# Altium schematic sheet мезанин.SchDoc
size 420 x 297 mm; SheetNumber: 2; SheetTotal: 6
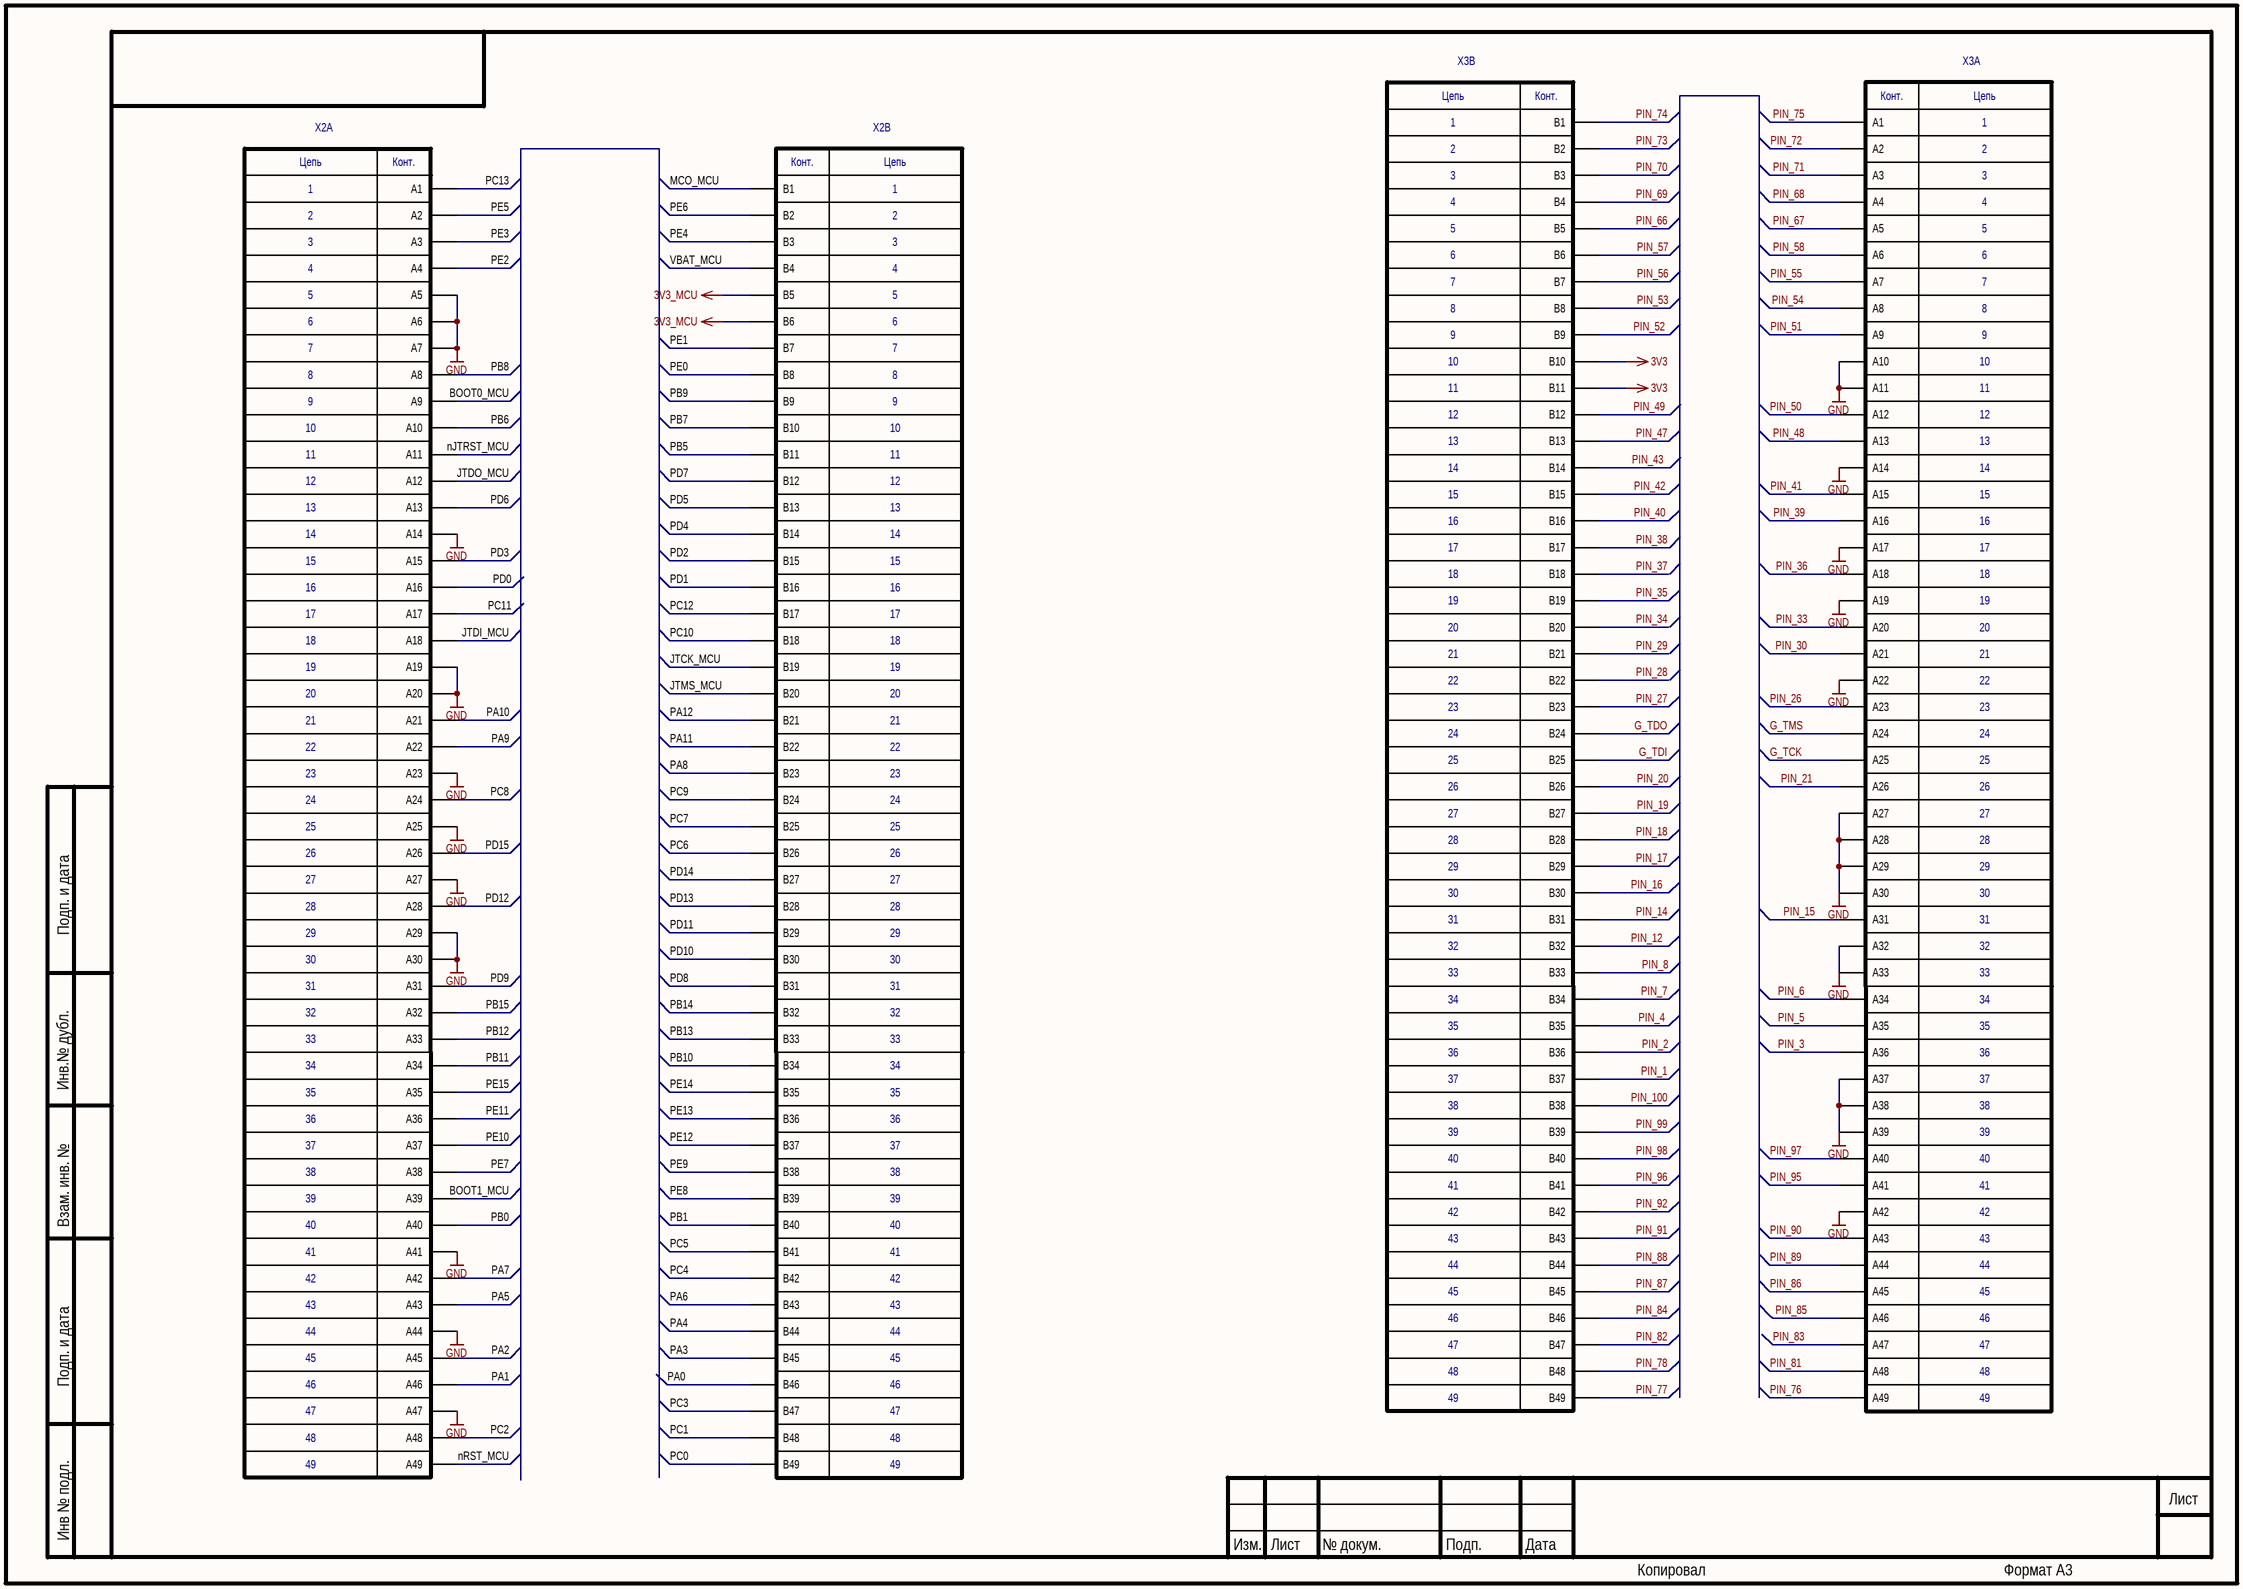
[diagram p0: мезанин.SchDoc]

## Parts
X2  KONT_POLE_MEZ  [3113-112T]  (value not drawn)  (parts A,B of 2)
X3  KONT_POLE_MEZ  [3113-112T]  (value not drawn)  (parts A,B of 2)

## Nets
3V3: X3.B10 X3.B11
3V3_MCU: X2.B5 X2.B6
GND: X2.A5 X2.A6 X2.A7 X2.A14 X2.A19 X2.A20 X2.A23 X2.A25 X2.A27 X2.A29 X2.A30 X2.A41 X2.A44 X2.A47 X3.A10 X3.A11 X3.A14 X3.A17 X3.A19 X3.A22 X3.A27 X3.A28 X3.A29 X3.A30 X3.A32 X3.A33 X3.A37 X3.A38 X3.A39 X3.A42
BOOT0_MCU: X2.A9
BOOT1_MCU: X2.A39
G_TCK: X3.A25
G_TDI: X3.B25
G_TDO: X3.B24
G_TMS: X3.A24
JTCK_MCU: X2.B19
JTDI_MCU: X2.A18
JTDO_MCU: X2.A12
JTMS_MCU: X2.B20
MCO_MCU: X2.B1
nJTRST_MCU: X2.A11
nRST_MCU: X2.A49
PA0: X2.B46
PA1: X2.A46
PA2: X2.A45
PA3: X2.B45
PA4: X2.B44
PA5: X2.A43
PA6: X2.B43
PA7: X2.A42
PA8: X2.B23
PA9: X2.A22
PA10: X2.A21
PA11: X2.B22
PA12: X2.B21
PB0: X2.A40
PB1: X2.B40
PB5: X2.B11
PB6: X2.A10
PB7: X2.B10
PB8: X2.A8
PB9: X2.B9
PB10: X2.B34
PB11: X2.A34
PB12: X2.A33
PB13: X2.B33
PB14: X2.B32
PB15: X2.A32
PC0: X2.B49
PC1: X2.B48
PC2: X2.A48
PC3: X2.B47
PC4: X2.B42
PC5: X2.B41
PC6: X2.B26
PC7: X2.B25
PC8: X2.A24
PC9: X2.B24
PC10: X2.B18
PC11: X2.A17
PC12: X2.B17
PC13: X2.A1
PD0: X2.A16
PD1: X2.B16
PD2: X2.B15
PD3: X2.A15
PD4: X2.B14
PD5: X2.B13
PD6: X2.A13
PD7: X2.B12
PD8: X2.B31
PD9: X2.A31
PD10: X2.B30
PD11: X2.B29
PD12: X2.A28
PD13: X2.B28
PD14: X2.B27
PD15: X2.A26
PE0: X2.B8
PE1: X2.B7
PE2: X2.A4
PE3: X2.A3
PE4: X2.B3
PE5: X2.A2
PE6: X2.B2
PE7: X2.A38
PE8: X2.B39
PE9: X2.B38
PE10: X2.A37
PE11: X2.A36
PE12: X2.B37
PE13: X2.B36
PE14: X2.B35
PE15: X2.A35
PIN_1: X3.B37
PIN_2: X3.B36
PIN_3: X3.A36
PIN_4: X3.B35
PIN_5: X3.A35
PIN_6: X3.A34
PIN_7: X3.B34
PIN_8: X3.B33
PIN_12: X3.B32
PIN_14: X3.B31
PIN_15: X3.A31
PIN_16: X3.B30
PIN_17: X3.B29
PIN_18: X3.B28
PIN_19: X3.B27
PIN_20: X3.B26
PIN_21: X3.A26
PIN_26: X3.A23
PIN_27: X3.B23
PIN_28: X3.B22
PIN_29: X3.B21
PIN_30: X3.A21
PIN_33: X3.A20
PIN_34: X3.B20
PIN_35: X3.B19
PIN_36: X3.A18
PIN_37: X3.B18
PIN_38: X3.B17
PIN_39: X3.A16
PIN_40: X3.B16
PIN_41: X3.A15
PIN_42: X3.B15
PIN_43: X3.B14
PIN_47: X3.B13
PIN_48: X3.A13
PIN_49: X3.B12
PIN_50: X3.A12
PIN_51: X3.A9
PIN_52: X3.B9
PIN_53: X3.B8
PIN_54: X3.A8
PIN_55: X3.A7
PIN_56: X3.B7
PIN_57: X3.B6
PIN_58: X3.A6
PIN_66: X3.B5
PIN_67: X3.A5
PIN_68: X3.A4
PIN_69: X3.B4
PIN_70: X3.B3
PIN_71: X3.A3
PIN_72: X3.A2
PIN_73: X3.B2
PIN_74: X3.B1
PIN_75: X3.A1
PIN_76: X3.A49
PIN_77: X3.B49
PIN_78: X3.B48
PIN_81: X3.A48
PIN_82: X3.B47
PIN_83: X3.A47
PIN_84: X3.B46
PIN_85: X3.A46
PIN_86: X3.A45
PIN_87: X3.B45
PIN_88: X3.B44
PIN_89: X3.A44
PIN_90: X3.A43
PIN_91: X3.B43
PIN_92: X3.B42
PIN_95: X3.A41
PIN_96: X3.B41
PIN_97: X3.A40
PIN_98: X3.B40
PIN_99: X3.B39
PIN_100: X3.B38
VBAT_MCU: X2.B4

## Notes on the sheet
- Подп. и дата
- Инв.№ дубл.
- Взам. инв. №
- Инв № подл.
- Изм.
- Лист
- № докум.
- Подп.
- Дата
- Копировал
- Формат А3
- (in symbol 3113-112T, part A) Конт.; Цепь; 1; 2; 3; 4; 5; 6; 7; 8; 9; 10; 11; 12; 13; 14; 15; 16; 17; 18; 19; 20; 21; 22; 23; 24; 25; 26; 27; 28; 29; 30; 31; 32; 33; 34; 35; 36; 37; 38; 39; 40; 41; 42; 43; 44; 45; 46; 47; 48; 49
- (in symbol 3113-112T, part B) Цепь; Конт.; 1; 2; 3; 4; 5; 6; 7; 8; 9; 10; 11; 12; 13; 14; 15; 16; 17; 18; 19; 20; 21; 22; 23; 24; 25; 26; 27; 28; 29; 30; 31; 32; 33; 34; 35; 36; 37; 38; 39; 40; 41; 42; 43; 44; 45; 46; 47; 48; 49

## Library data of the parts
X2 X3 = 3113-112T